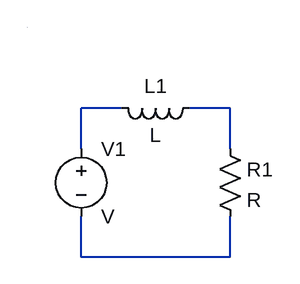
[diagram p0: schematic LC_Circuit.asc]
LC_Circuit.asc, the LTspice schematic file:
Version 4.1
SHEET 1 880 680
WIRE 112 96 64 96
WIRE 240 96 192 96
WIRE 64 144 64 96
WIRE 240 144 240 96
WIRE 64 272 64 224
WIRE 240 272 240 224
WIRE 240 272 64 272
WIRE 0 0 0 0
SYMBOL ind 208 80 R90
WINDOW 0 5 56 VBottom 2
WINDOW 3 32 56 VTop 2
SYMATTR InstName L1
SYMBOL res 224 128 R0
SYMATTR InstName R1
SYMBOL voltage 64 128 R0
SYMATTR InstName V1

The netlist it stands for:
* LC_Circuit.asc
L1 N002 N001 L
R1 N002 N003 R
V1 N001 N003 V
.backanno
.end